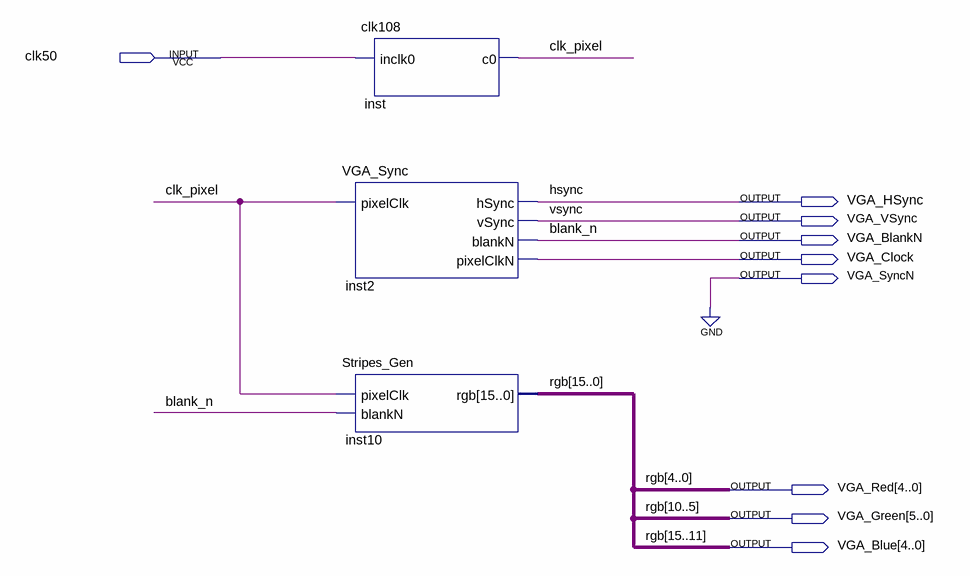
[diagram p0: schematic sheet]
// Quartus schematic VGA_stripes.bdf as structural Verilog: 3 symbols, 9 pins
module VGA_stripes (
  input  clk50,
  output VGA_HSync,
  output VGA_VSync,
  output VGA_BlankN,
  output VGA_Clock,
  output VGA_SyncN,
  output [4:0] VGA_Red,
  output [5:0] VGA_Green,
  output [4:0] VGA_Blue
);

  wire clk_pixel;

  clk108 inst (.inclk0(clk50), .c0(clk_pixel));
  VGA_Sync inst2 (
    .pixelClk(clk_pixel), .hSync(VGA_HSync), .vSync(VGA_VSync), .blankN(VGA_BlankN), .pixelClkN(VGA_Clock));
  Stripes_Gen inst10 (.pixelClk(clk_pixel), .blankN(VGA_BlankN), .rgb({VGA_Blue, VGA_Green, VGA_Red}));

  assign VGA_SyncN = 1'b0;

  // Other names for the same wires on the sheet: blank_n = VGA_BlankN; hsync = VGA_HSync;
  //   rgb[15:0] = {VGA_Blue, VGA_Green, VGA_Red}; vsync = VGA_VSync
endmodule
